# Altium schematic sheet TMP117.SchDoc: TMP117 Schematic
size A4; SheetNumber: 1; SheetTotal: 8
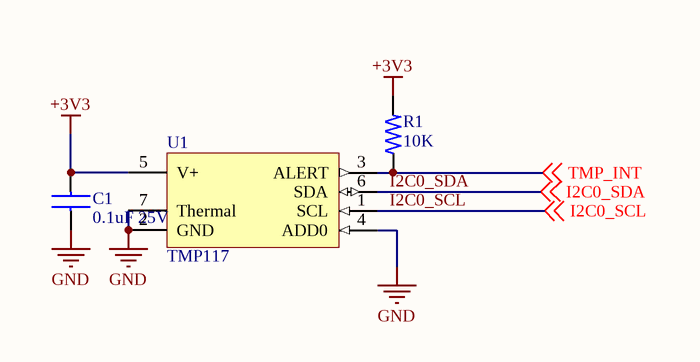
[diagram p0: TMP117.SchDoc]

## Parts
C1  0.1uF 25V  [Chip2Pin_1.6x0.8x0.9_CAP]
R1  10K  [RES_0603_1608X06]
U1  TMP117  [6-DFN-2x2]

## Nets
+3V3: C1.1 R1.2 U1.5(V+)
GND: C1.2 U1.2(GND) U1.4(ADD0) U1.7(Thermal)
I2C0_SCL: U1.1(SCL) ; off-sheet I2C0_SCL
I2C0_SDA: U1.6(SDA) ; off-sheet I2C0_SDA
TMP_INT: R1.1 U1.3(ALERT) ; off-sheet TMP_INT

## Library data of the parts
C1 = GCJ188R71E104KA12D: Cap Ceramic 0.1uF 25V X7R 10% Pad SMD 0603 Soft Termination 125C Automotive T/R; Manufacturer: Murata; Value: 100nF; Supplier 1: Arrow Electronics; Manufacturer Part Number: GCJ188R71E104KA12D; RoHS: Yes; Category: Ceramic Capacitors; Stock 1: 11360; Pricing 1: 1=0.14710, 10=0.11710, 25=0.11140, 100=0.11030, 250=0.10920, 500=0.10810, 1000=0.10700, 3000=0.10600, 6000=0.10490 (USD); Mounting Technology: Surface Mount; Case/Package: 0603; Case Code (Imperial): 0603; Case Code (Metric): 1608; Min Operating Temperature: -55°C; Max Operating Temperature: 125°C; Features: Soft Termination; Packaging: Tape and Reel; Tolerance: 10%; Voltage Rating: 25V; Ratings: AEC-Q200; RoHS Compliant: Yes; ComponentLink1URL: http://search.murata.co.jp/Ceramy/image/img/A01X/G101/ENG/GCJ188R71E104KA12-01.pdf?src-supplier=Digi-Key; ComponentLink1Description: http://search.murata.co.jp/Ceramy/image/img/A01X/G101/ENG/GCJ188R71E104KA12-01.pdf?src-supplier=Digi-Key
R1 = RT0603DRD0710KL: Res Thin Film 0603 10K Ohm 0.5% 1/10W ±25ppm/°C Molded SMD Paper T/R; Manufacturer: Yageo; Value: 10kR; Power Rating: 100mW; Voltage Rating (DC): 50V; Supplier 1: Future Electronics; Manufacturer Part Number: RT0603DRD0710KL; RoHS: Yes; Category: Chip SMD Resistors; Stock 1: 160000; Pricing 1: 5000=0.01490, 15000=0.01440, 25000=0.01420, 100000=0.01350, 150000=0.01310 (USD); Case/Package: 0603; Case Code (Imperial): 0603; Case Code (Metric): 1608; Min Operating Temperature: -55°C; Max Operating Temperature: 155°C; Tolerance: 0.5%; Packaging: Tape and Reel; Resistor Type: Thin Film; Temperature Coefficient: 25ppm/°C; Series: RT; Max Power Dissipation: 100mW; Number of Terminations: 2; Construction: Rectangular; Length: 1.6mm; Width: 800um; Depth: 0.8mm; Military Standard: Not; Lead Free: Lead Free; RoHS Compliant: Yes; ComponentLink1URL: http://www.yageo.com/documents/recent/PYu-RT_1-to-0.01_RoHS_L_9.pdf?src-supplier=Digi-Key; ComponentLink1Description: http://www.yageo.com/documents/recent/PYu-RT_1-to-0.01_RoHS_L_9.pdf?src-supplier=Digi-Key; ComponentLink2URL: http://www.yageo.com/documents/recent/PYu-RT_1-to-0.05_RoHS_L_(4).pdf?src-supplier=Future+Electronics; ComponentLink2Description: http://www.yageo.com/documents/recent/PYu-RT_1-to-0.05_RoHS_L_(4).pdf?src-supplier=Future+Electronics
U1 = TMP117MAIDRVT: 0.1C digital temperature sensor, 48-bit EEPROM, PT100/PT1000 RTD replacement 6-WSON 0 to 85; Manufacturer: Texas Instruments; Output Type: I2C; Resolution: 16b; Supplier 1: Arrow Electronics; Manufacturer Part Number: TMP117MAIDRVT; RoHS: Yes; Category: Integrated Circuits (ICs); Stock 1: 833; Pricing 1: 1=5.04400, 10=3.92300, 25=3.16500, 100=2.70300, 250=2.56100, 500=2.22300 (USD); Mounting Technology: Surface Mount; Min Operating Temperature: -55°C; Max Operating Temperature: 150°C; Packaging: Tape and Reel; RoHS Compliant: Yes; ComponentLink1URL: http://www.ti.com/lit/ds/symlink/tmp117.pdf?src-supplier=Digi-Key; ComponentLink1Description: http://www.ti.com/lit/ds/symlink/tmp117.pdf?src-supplier=Digi-Key